# Altium schematic sheet Sensor current 100A.SchDoc
size A4; Organization: Altium Limited; Address1: 3 Minna Close; Address2: Belrose; Address3: NSW 2085; Address4: Australia
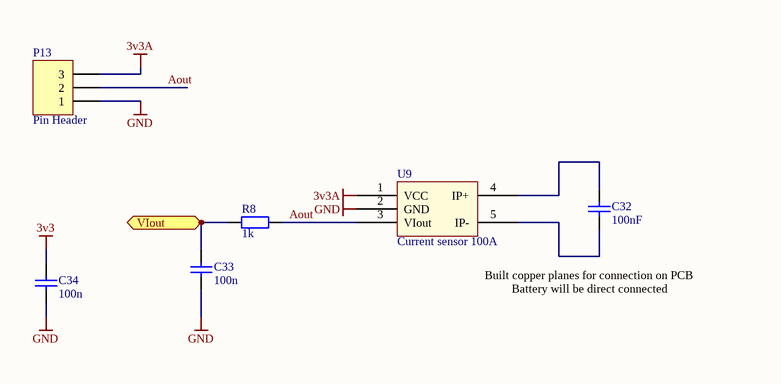
[diagram p0: Sensor current 100A.SchDoc]

## Parts
C32  100nF  [C1206]
C33  100n  [C0805]
C34  100n  [C0805]
P13  Pin Header  [PH1x3_2.54]
R8  value 1k  [R0805]  (hidden comment: RESISTOR)
U9  Current sensor 100A  [unique-ACS758xCB]

## Ports
VIout (out)

## Nets
3v3: C34.2
3v3A: P13.3 U9.1(VCC)
GND: C33.1 C34.1 P13.1 U9.2(GND)
Aout: P13.2 R8.1 U9.3(VIout)
VIout: C33.2 R8.2 ; port VIout
NetC32_1: C32.1 U9.5(IP-)
NetC32_2: C32.2 U9.4(IP+)

## Notes on the sheet
- Built copper planes for connection on PCB
- Battery will be direct connected
- Title
- Size:
- Date:
- A4
- Name:
- Time:
- Ing. W. Pietersz
- Revision:
- Sheet
- of
- WillyPietersz@gmail.com
- Contact:
- info@unique-system.nl
- Unique System Elektronics
- Biesboschhaven noord 1-b
- 4251 NL Werkendam
- Netherlands
- www.unique-system.nl
- File:

## Library data of the parts
C32 = 0.1uF: Part Number: 0.1uF; Value: 0.1uF; Voltage: 50V; Type: Ceramic; Tolerance: 0.1; LatestRevision Note: Initial Release; Package: 1206; Component Type: Standard; LatestRevision Date: 14-9-2010; Author: Willem Pietersz; Supplier 2: Farnell; Supplier Part Number 2: 1759361; ComponentLink1Description: Manufacturer; ComponentLink2Description: Datasheet
C33 C34 = 100n: Tolerance: 0.1; LatestRevision Note: Initial Release; Part Number: 100n; Value: 100n; Package: 0805; Component Type: Standard; LatestRevision Date: 31-7-2010; Author: Willy Pietersz; Supplier 2: Farnell; Supplier Part Number 2: 1759266; ComponentLink1Description: Manufacturer; ComponentLink2Description: Datasheet
P13 = PH1x3: Con1x3; Part Number: PH1x3; Pitch: 2.54; LatestRevision Note: Initial Release; Type: Pin Header; Number Of Pins: 3; Component Type: Standard; LatestRevision Date: 23-11-2010; Author: Willy Pietersz; Supplier 2: Farnell
R8 = 1K: Manufacturer 1: Panasonic; Manufacturer 1 Part No: ERJT06J102V; Power: 0.25W; Tolerance: 0.05; LatestRevision Note: Initial Release; Published: 8-Jun-2000; LatestRevisionDate: 17-Jul-2002; LatestRevisionNote: Re-released for DXP Platform.; PackageReference: AXIAL-0.4; Publisher: Altium Limited; Part Number: 1K; Type: Film; Package: 0805; Component Type: Standard; LatestRevision Date: 30-7-2010; Author: Willy Pietersz; ROHS: Y; Supplier 2: Farnell; Supplier Part Number 2: 1618241; ComponentLink1Description: Manufacturer; ComponentLink2Description: Datasheet
U9 = ACS758xCB: Sensor, Current; Part Number: ACS758xCB; Component Type: Sensor; Supplier 1: Digikey; Supplier Part Number 1: 620-1321-ND; Supplier 2: Farnell; Supplier Part Number 2: 1791393; ComponentLink1Description: Datasheet; ComponentLink1URL: http://www.allegromicro.com/en/Products/Part_Numbers/0758/0758.pdf